# EAGLE design PIC12F629 (EAGLE 7.7.0)
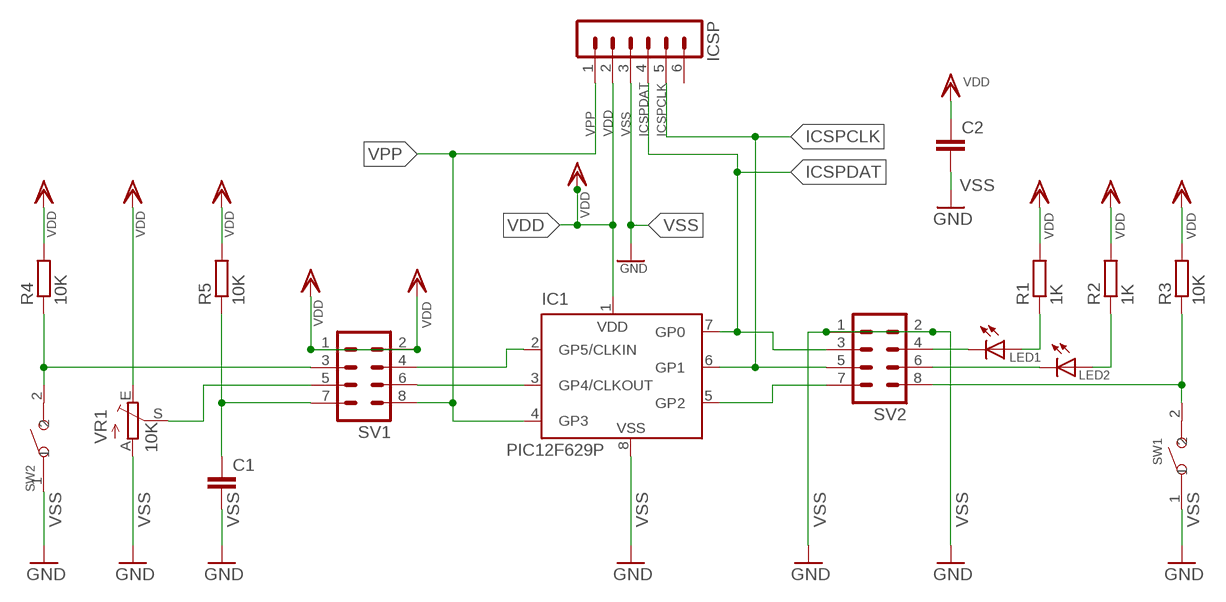
[diagram p0: schematic, sheet 1]

## Parts
C1  C-EUC0805K  [C0805K]
C2  C-EUC0805K  [C0805K]
IC1  PIC12F629P  [DIL8]
ICSP  MA06-1  [MA06-1]
LED1  LEDCHIP-LED0805  [CHIP-LED0805]
LED2  LEDCHIP-LED0805  [CHIP-LED0805]
R1  1K  R-EU_R0805  [R0805]
R2  1K  R-EU_R0805  [R0805]
R3  10K  R-EU_R0805  [R0805]
R4  10K  R-EU_R0805  [R0805]
R5  10K  R-EU_R0805  [R0805]
SV1  MA04-2  [MA04-2]
SV2  MA04-2  [MA04-2]
SW1  SMD-BUTTON(2P-6.0X3.0X2.5MM)-DHT-1163S  [SW2-4.0-6.0X3.0X2.5MM]
SW2  SMD-BUTTON(2P-6.0X3.0X2.5MM)-DHT-1163S  [SW2-4.0-6.0X3.0X2.5MM]
VR1  10K  TRIM_EU-CA6V  [CA6V]

## Nets
ICSPCLK: IC1.6(GP1) ICSP.5 SV2.5
ICSPDAT: IC1.7(GP0) ICSP.4 SV2.3
N$1: IC1.3(GP4/CLKOUT) SV1.6
N$2: IC1.5(GP2) SV2.7
N$3: IC1.2(GP5/CLKIN) SV1.4
N$4: LED1.C SV2.4
N$5: LED2.C SV2.6
N$6: LED1.A R1.1
N$7: LED2.A R2.1
N$8: R3.1 SV2.8 SW1.2
N$9: R4.1 SV1.3 SW2.2
N$10: SV1.5 VR1.S
N$11: C1.1 R5.1 SV1.7
VDD: C2.1 IC1.1(VDD) ICSP.2 R1.2 R2.2 R3.2 R4.2 R5.2 SV1.1 SV1.2 VR1.E
VPP: IC1.4(GP3) ICSP.1 SV1.8
VSS: C1.2 C2.2 IC1.8(VSS) ICSP.3 SV2.1 SV2.2 SW1.1 SW2.1 VR1.A ; supply symbol labelled GND
Unconnected: ICSP.6

## Library data of the parts
C1 C2 = resistor:C-EU: CAPACITOR, European symbol
IC1 = microchip:PIC12F6*: Data Sheet 8-Pin FLASH-Based 8-Bit CMOS Microcontrollers Source: http://www.microchip.com .. 41190c.pdf; MF: MICROCHIP; MPN: PIC12F629-I/P; OC_FARNELL: 1292253; OC_NEWARK: 67K0822
ICSP = con-lstb:MA06-1: PIN HEADER; OC_FARNELL: unknown; OC_NEWARK: unknown
LED1 LED2 = led:LED: LED OSRAM: - CHIPLED LG R971, LG N971, LY N971, LG Q971, LY Q971, LO R971, LY R971 LH N974, LH R974 LS Q976, LO Q976, LY Q976 LO Q996 - Hyper CHIPLED LW Q18S LB Q993, LB Q99A, LB R99A - SideLED LS A670, LO A670, LY A670, LG A670, LP A670 LB A673, LV A673, LT A673, LW A673 LH A674 LY A675 LS A676, LA A676, LO A676, LY A676, LW A676 LS A679, LY A679, LG A679 - Hyper Micro SIDELED® LS Y876, LA Y876, LO Y876, LY Y876 LT Y87S - SmartLED LW L88C, LW L88S LB L89C, LB L89S, LG L890 LS L89K, LO L89K, LY L89K LS L896, LA L896, LO L896, LY L896 - TOPLED LS T670, LO T670, LY T670, LG T670, LP T670 LSG T670, LSP T670, LSY T670, LOP T670, LYG T670 LG T671, LOG T671, LSG T671 LB T673, LV T673, LT T673, LW T673 LH T674 LS T676, LA T676, LO T676, LY T676, LB T676, LH T676, LSB T676, LW T676 LB T67C, LV T67C, LT T67C, LS T67K, LO T67K, LY T67K, LW E67C LS E67B, LA E67B, LO E67B, LY E67B, LB E67C, LV E67C, LT E67C LW T67C LS T679, LY T679, LG T679 LS T770, LO T770, LY T770, LG T770, LP T770 LB T773, LV T773, LT T773, LW T773 LH T774 LS E675, LA E675, LY E675, LS T675 LS T776, LA T776, LO T776, LY T776, LB T776 LHGB T686 LT T68C, LB T68C - Hyper Mini TOPLED® LB M676 - Mini TOPLED Santana® LG M470 LS M47K, LO M47K, LY M47K Source: http://www.osram.convergy.de LUXEON: - LUMILED® LXK2-PW12-R00, LXK2-PW12-S00, LXK2-PW14-U00, LXK2-PW14-V00 LXK2-PM12-R00, LXK2-PM12-S00, LXK2-PM14-U00 LXK2-PE12-Q00, LXK2-PE12-R00, LXK2-PE12-S00, LXK2-PE14-T00, LXK2-PE14-U00 LXK2-PB12-K00, LXK2-PB12-L00, LXK2-PB12-M00, LXK2-PB14-N00, LXK2-PB14-P00, LXK2-PB14-Q00 LXK2-PR12-L00, LXK2-PR12-M00, LXK2-PR14-Q00, LXK2-PR14-R00 LXK2-PD12-Q00, LXK2-PD12-R00, LXK2-PD12-S00 LXK2-PH12-R00, LXK2-PH12-S00 LXK2-PL12-P00, LXK2-PL12-Q00, LXK2-PL12-R00 Source: www.luxeon.com KINGBRIGHT: KA-3528ASYC Source: www.kingbright.com
R1-R5 = rcl:R-EU_: RESISTOR, European symbol
SV1 SV2 = con-lstb:MA04-2: PIN HEADER; OC_FARNELL: unknown; OC_NEWARK: unknown
SW1 SW2 = Seeed-OPL-Switch:SMD-BUTTON(2P-6.0X3.0X2.5MM): 311020029
VR1 = pot:TRIM_EU-: POTENTIOMETER

## Net classes
0 default: width 0.152 mm, clearance 0.152 mm

## Board
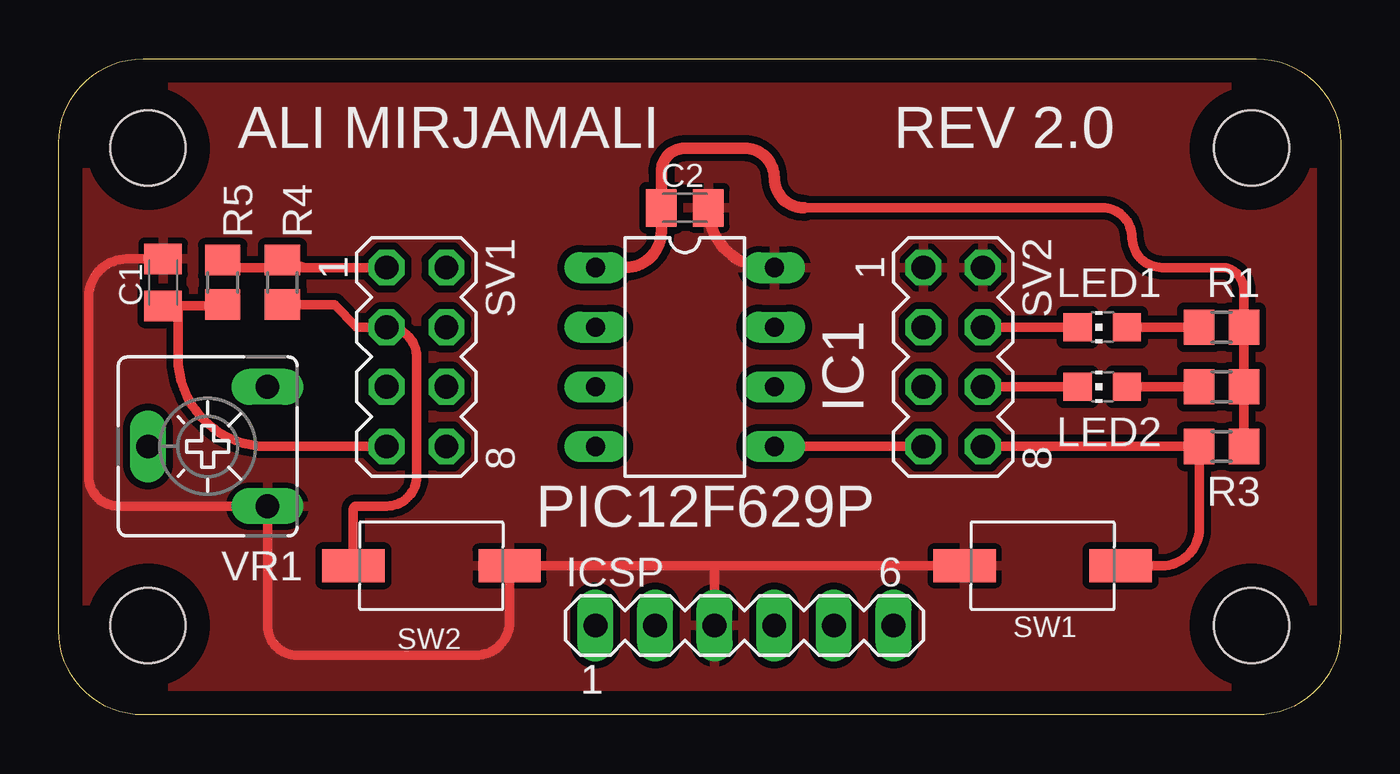
[diagram p1: board, top side]
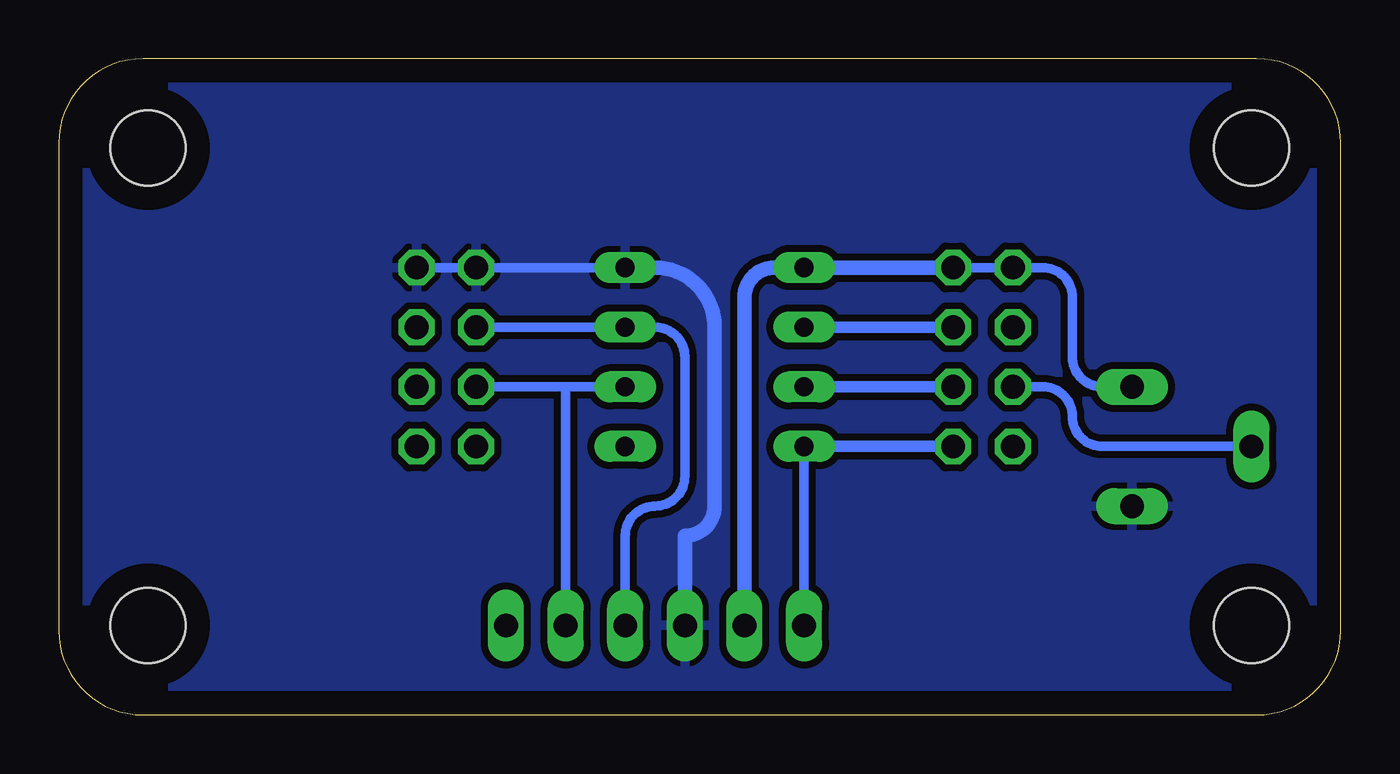
[diagram p2: board, bottom side, seen from below]

Size 54.61 x 27.94 mm. Coordinates in mm from the lower left corner, seen from the top.
Outline: 54.61,24.35 54.61,3.59 arc-90 51.02,0 3.59,0 arc-90 0,3.59 0,24.35 arc-90 3.59,27.94 51.02,27.94 arc-90 54.61,24.35
Copper layers (1*16): Top 0.035mm / dielectric 1.5mm / Bottom 0.035mm
Design rules "default *": minimum track width 10mil, minimum drill 24mil, track to track 0.3mm, track to pad 0.3mm, pad to pad 0.3mm, via to via 0.3mm, smd to smd 0.3mm, copper to edge 40mil, drill to drill 8mil, minimum pad ring 10mil, minimum via ring 8mil, stop-mask expansion 4mil, vias tented up to drill 0mil, thermal gap 10mil
Holes 3.2 mm at 3.81,24.13 50.8,3.81 50.8,24.13 3.81,3.81

### Footprints (pad centres in the part's own frame; a part is rotated, then mirrored left to right if it is on the bottom)
C0805K = smd 1.3 x 1.6: 1 -1,0; 2 1,0
DIL8 = drill 0.813 long: 1 -3.81,-3.81; 2 -1.27,-3.81; 3 1.27,-3.81; 4 3.81,-3.81; 5 3.81,3.81; 6 1.27,3.81; 7 -1.27,3.81; 8 -3.81,3.81
MA06-1 = drill 1.016 long: 1 -6.35,0; 2 -3.81,0; 3 -1.27,0; 4 1.27,0; 5 3.81,0; 6 6.35,0
CHIP-LED0805 = smd 1.2 x 1.2: A 0,-1.05; C 0,1.05
R0805 = smd 1.3 x 1.5: 1 -0.95,0; 2 0.95,0
MA04-2 = drill 1.016 octagon: 1 -3.81,-1.27; 2 -3.81,1.27; 3 -1.27,-1.27; 4 -1.27,1.27; 5 1.27,-1.27; 6 1.27,1.27; 7 3.81,-1.27; 8 3.81,1.27
SW2-4.0-6.0X3.0X2.5MM = smd 2.65 x 1.4: 1 -3.325,0; 2 3.325,0
CA6V = drill 1.016 long: A -2.54,-2.54; E 2.54,-2.54; S 0,2.54

### Placement (x,y rotation side)
C1  4.45,18.41 90 top
C2  26.67,21.59 0 top
IC1  26.67,15.24 270 top
ICSP  29.21,3.81 0 top
LED1  44.45,16.51 90 top
LED2  44.45,13.97 90 top
R1  49.53,16.51 0 top
R2  49.53,13.97 0 top
R3  49.53,11.43 0 top
R4  9.53,18.41 90 top
R5  6.99,18.41 90 top
SV1  15.24,15.24 270 top
SV2  38.1,15.24 270 top
SW1  41.91,6.35 0 top
SW2  15.88,6.35 180 top
VR1  6.35,11.43 90 top

### Tracks (layer width: path | path; a pad name or v marks a point on that pad's centre or on a via)
ICSPCLK
  Bottom 0.406: SV2.5 33.02,13.97 | 33.02,13.97 IC1.6 | ICSP.5 33.02,13.97
ICSPDAT
  Bottom 0.406: SV2.3 IC1.7 29.21,16.51 arc90 27.94,15.24 27.94,10.16 arc90 29.21,8.89 arc-90 30.48,7.62 ICSP.4
N$1
  Bottom 0.5: IC1.3 SV1.6
N$2
  Top 0.406: IC1.5 SV2.7
N$3
  Bottom 0.5: IC1.2 SV1.4
N$4
  Top 0.406: LED1.C SV2.4
N$5
  Top 0.406: LED2.C SV2.6
N$6
  Top 0.406: LED1.A R1.1
N$7
  Top 0.406: LED2.A R2.1
N$8
  Top 0.406: SV2.8 R3.1 48.58,7.94 arc-90 46.99,6.35 SW1.2
N$9
  Top 0.406: R4.1 11.74,17.46 12.7,16.51 SV1.3 arc-90 15.24,15.24 15.24,10.16 arc-90 13.97,8.89 12.7,8.89 arc90 12.55,8.74 SW2.2
N$10
  Bottom 0.406: SV1.5 12.7,13.97 arc90 11.43,12.7 arc-90 10.16,11.43 VR1.S
N$11
  Top 0.406: C1.1 5.08,17.41 | 5.08,17.41 6.99,17.41 R5.1 | SV1.7 8.89,11.43 arc-90 5.08,15.24 5.08,17.41
VDD
  Top 0.406: R3.2 R2.2 R1.2 50.48,18.1 arc90 49.53,19.05 46.99,19.05 arc-90 45.72,20.32 arc90 44.45,21.59 31.75,21.59 | SV1.1 10.47,19.05 | 10.47,19.05 R4.2 | 10.47,19.05 6.99,19.05 R5.2
  Top 0.5: IC1.1 24.13,19.05 arc90 25.67,20.59 C2.1 25.67,23.13 arc-90 26.67,24.13 29.21,24.13 arc-90 30.48,22.86 arc90 31.75,21.59
  Bottom 0.406: SV1.2 SV1.1 12.7,19.05 arc90 11.43,17.78 11.43,15.24 arc-90 10.16,13.97 VR1.E | 24.13,19.05 IC1.1
  Bottom 0.61: ICSP.2 25.4,17.78 arc90 24.13,19.05 | SV1.2 IC1.1
VPP
  Bottom 0.406: ICSP.1 IC1.4
  Bottom 0.5: IC1.4 SV1.8
VSS
  Top 0.406: 27.94,5.08 ICSP.3 27.94,6.35 | 27.94,6.35 SW2.1 19.2,3.96 arc-90 17.78,2.54 10.16,2.54 arc-90 8.89,3.81 VR1.A 2.54,8.89 arc-90 1.27,10.16 1.27,17.78 arc-90 2.9,19.41 C1.2 | SW1.1 27.94,6.35
  Top 0.5: C2.2 arc90 30.21,19.05 IC1.8
  Bottom 0.406: SV2.2 SV2.1 IC1.8 29.21,19.05
  Bottom 0.61: ICSP.3 27.94,7.62 arc-90 26.67,8.89 26.67,16.51 arc-90 29.21,19.05
  pour Bottom: 3.59,0 51.02,0 arc90 54.61,3.59 54.61,24.35 arc90 51.02,27.94 4.02,27.94 arc90 0,23.92 0,3.59 arc90
  pour Top: 3.59,0 51.02,0 arc90 54.61,3.59 54.61,24.35 arc90 51.02,27.94 4.02,27.94 arc90 0,23.92 0,3.59 arc90

### Text on the board
tNames: ALI MIRJAMALI | REV 2.0